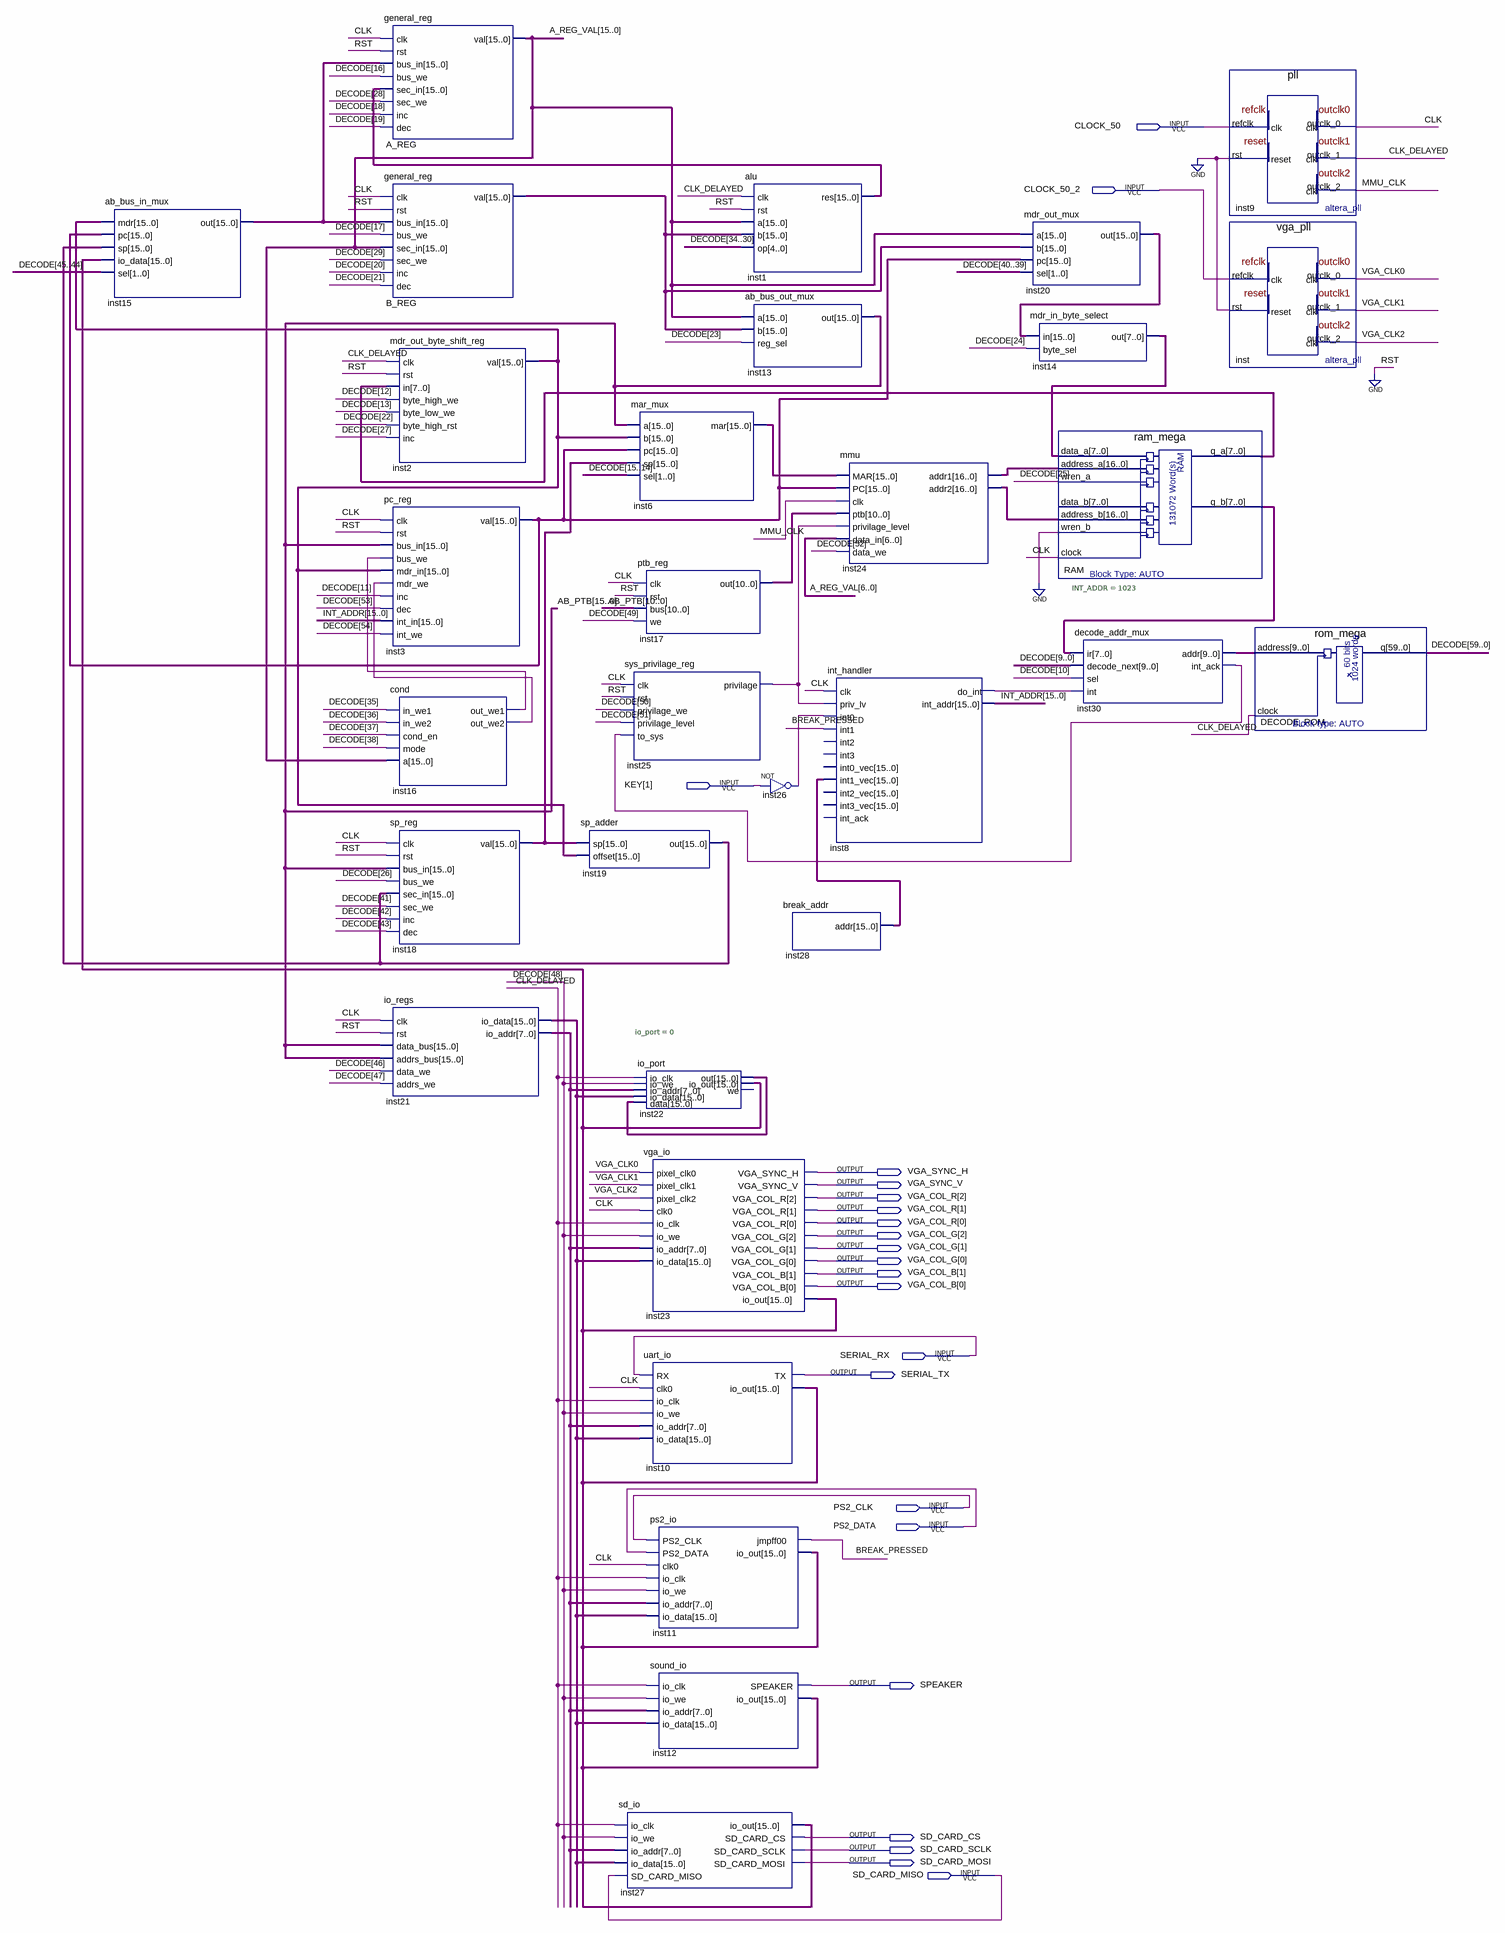
[diagram p0: schematic sheet]
// Quartus schematic scp.bdf as structural Verilog: 31 symbols, 22 pins
module scp (
  input  CLOCK_50,
  input  CLOCK_50_2,
  input  [1:1] KEY,
  input  SERIAL_RX,
  input  PS2_CLK,
  input  PS2_DATA,
  input  SD_CARD_MISO,
  output VGA_SYNC_H,
  output VGA_SYNC_V,
  output [2:0] VGA_COL_R,
  output [2:0] VGA_COL_G,
  output [1:0] VGA_COL_B,
  output SERIAL_TX,
  output SPEAKER,
  output SD_CARD_CS,
  output SD_CARD_SCLK,
  output SD_CARD_MOSI
);

  wire BREAK_PRESSED, CLK, CLK_DELAYED, inst8_do_int, inst16_out_we1, inst16_out_we2, inst25_privilage,
       inst26_out, inst30_int_ack, MMU_CLK, VGA_CLK0, VGA_CLK1, VGA_CLK2;
  wire [7:0] inst14_out, inst21_io_addr, RAM_q_a, RAM_q_b;
  wire [9:0] inst30_addr;
  wire [10:0] inst17_out;
  wire [15:0] A_REG_VAL, AB_PTB, B_REG_val, inst1_res, inst2_val, inst3_val, inst6_mar, inst15_out,
       inst18_val, inst19_out, inst20_out, inst21_io_data, inst22_io_out, inst22_out, inst28_addr, INT_ADDR;
  wire [16:0] inst24_addr1, inst24_addr2;
  wire [59:0] DECODE;

  ab_bus_in_mux inst15 (
    .mdr(inst2_val), .pc(inst3_val), .sp(inst19_out), .io_data(inst22_io_out), .sel(DECODE[45:44]),
    .out(inst15_out));
  general_reg A_REG (
    .clk(CLK), .rst(1'b0), .bus_in(inst15_out), .bus_we(DECODE[16]), .sec_in(inst1_res), .sec_we(DECODE[28]),
    .inc(DECODE[18]), .dec(DECODE[19]), .val(A_REG_VAL));
  general_reg B_REG (
    .clk(CLK), .rst(1'b0), .bus_in(inst15_out), .bus_we(DECODE[17]), .sec_in(A_REG_VAL), .sec_we(DECODE[29]),
    .inc(DECODE[20]), .dec(DECODE[21]), .val(B_REG_val));
  mdr_out_byte_shift_reg inst2 (
    .clk(CLK_DELAYED), .rst(1'b0), .in(RAM_q_a), .byte_high_we(DECODE[12]), .byte_low_we(DECODE[13]),
    .byte_high_rst(DECODE[22]), .inc(DECODE[27]), .val(inst2_val));
  pc_reg inst3 (
    .clk(CLK), .rst(1'b0), .bus_in(AB_PTB), .bus_we(inst16_out_we1), .mdr_in(inst2_val),
    .mdr_we(inst16_out_we2), .inc(DECODE[11]), .dec(DECODE[53]), .int_in(INT_ADDR), .int_we(DECODE[54]),
    .val(inst3_val));
  cond inst16 (
    .in_we1(DECODE[35]), .in_we2(DECODE[36]), .cond_en(DECODE[37]), .mode(DECODE[38]), .a(A_REG_VAL),
    .out_we1(inst16_out_we1), .out_we2(inst16_out_we2));
  sp_reg inst18 (
    .clk(CLK), .rst(1'b0), .bus_in(AB_PTB), .bus_we(DECODE[26]), .sec_in(inst19_out), .sec_we(DECODE[41]),
    .inc(DECODE[42]), .dec(DECODE[43]), .val(inst18_val));
  io_regs inst21 (
    .clk(CLK), .rst(1'b0), .data_bus(AB_PTB), .addrs_bus(AB_PTB), .data_we(DECODE[46]),
    .addrs_we(DECODE[47]), .io_data(inst21_io_data), .io_addr(inst21_io_addr));
  sp_adder inst19 (.sp(inst18_val), .offset(inst2_val), .out(inst19_out));
  mar_mux inst6 (.a(AB_PTB), .b(inst2_val), .pc(inst3_val), .sp(inst18_val), .sel(DECODE[15:14]), .mar(inst6_mar));
  ptb_reg inst17 (.clk(CLK), .rst(1'b0), .bus(AB_PTB[10:0]), .we(DECODE[49]), .out(inst17_out));
  sys_privilage_reg inst25 (
    .clk(CLK), .rst(1'b0), .privilage_we(DECODE[50]), .privilage_level(DECODE[51]), .to_sys(inst30_int_ack),
    .privilage(inst25_privilage));
  io_port #(.io_port(0)) inst22 (
    .io_clk(CLK_DELAYED), .io_we(DECODE[48]), .io_addr(inst21_io_addr), .io_data(inst21_io_data),
    .data(inst22_out), .out(inst22_out), .io_out(inst22_io_out));  // open: we
  vga_io inst23 (
    .pixel_clk0(VGA_CLK0), .pixel_clk1(VGA_CLK1), .pixel_clk2(VGA_CLK2), .clk0(CLK), .io_clk(CLK_DELAYED),
    .io_we(DECODE[48]), .io_addr(inst21_io_addr), .io_data(inst21_io_data), .VGA_SYNC_H(VGA_SYNC_H),
    .VGA_SYNC_V(VGA_SYNC_V), .VGA_COL_R(VGA_COL_R), .VGA_COL_G(VGA_COL_G), .VGA_COL_B(VGA_COL_B),
    .io_out(inst22_io_out));
  uart_io inst10 (
    .RX(SERIAL_RX), .clk0(CLK), .io_clk(CLK_DELAYED), .io_we(DECODE[48]), .io_addr(inst21_io_addr),
    .io_data(inst21_io_data), .TX(SERIAL_TX), .io_out(inst22_io_out));
  ps2_io inst11 (
    .PS2_CLK(PS2_CLK), .PS2_DATA(PS2_DATA), .clk0(CLK), .io_clk(CLK_DELAYED), .io_we(DECODE[48]),
    .io_addr(inst21_io_addr), .io_data(inst21_io_data), .jmpff00(BREAK_PRESSED), .io_out(inst22_io_out));
  sound_io inst12 (
    .io_clk(CLK_DELAYED), .io_we(DECODE[48]), .io_addr(inst21_io_addr), .io_data(inst21_io_data),
    .SPEAKER(SPEAKER), .io_out(inst22_io_out));
  sd_io inst27 (
    .io_clk(CLK_DELAYED), .io_we(DECODE[48]), .io_addr(inst21_io_addr), .io_data(inst21_io_data),
    .SD_CARD_MISO(SD_CARD_MISO), .io_out(inst22_io_out), .SD_CARD_CS(SD_CARD_CS),
    .SD_CARD_SCLK(SD_CARD_SCLK), .SD_CARD_MOSI(SD_CARD_MOSI));
  alu inst1 (.clk(CLK_DELAYED), .rst(1'b0), .a(A_REG_VAL), .b(B_REG_val), .op(DECODE[34:30]), .res(inst1_res));
  ab_bus_out_mux inst13 (.a(A_REG_VAL), .b(B_REG_val), .reg_sel(DECODE[23]), .out(AB_PTB));
  not inst26 (inst26_out, KEY[1]);
  break_addr inst28 (.addr(inst28_addr));
  mmu inst24 (
    .MAR(inst6_mar), .PC(inst3_val), .clk(MMU_CLK), .ptb(inst17_out), .privilage_level(inst25_privilage),
    .data_in(A_REG_VAL[6:0]), .data_we(DECODE[52]), .addr1(inst24_addr1), .addr2(inst24_addr2));
  int_handler inst8 (
    .clk(CLK), .priv_lv(inst25_privilage), .int0(inst26_out), .int1(BREAK_PRESSED), .int1_vec(inst28_addr),
    .do_int(inst8_do_int), .int_addr(INT_ADDR));  // open: int2, int3, int0_vec, int2_vec, int3_vec, int_ack
  mdr_out_mux inst20 (.a(A_REG_VAL), .b(B_REG_val), .pc(inst3_val), .sel(DECODE[40:39]), .out(inst20_out));
  mdr_in_byte_select inst14 (.in(inst20_out), .byte_sel(DECODE[24]), .out(inst14_out));
  ram_mega RAM (
    .data_a(inst14_out), .address_a(inst24_addr1), .wren_a(DECODE[25]), .address_b(inst24_addr2),
    .wren_b(1'b0), .clock(CLK), .q_a(RAM_q_a), .q_b(RAM_q_b));  // open: data_b
  decode_addr_mux #(.INT_ADDR(1023)) inst30 (
    .ir(RAM_q_b), .decode_next(DECODE[9:0]), .sel(DECODE[10]), .\int (inst8_do_int), .addr(inst30_addr),
    .int_ack(inst30_int_ack));
  pll inst9 (.refclk(CLOCK_50), .rst(1'b0), .outclk_0(CLK), .outclk_1(CLK_DELAYED), .outclk_2(MMU_CLK));
  vga_pll inst (.refclk(CLOCK_50_2), .rst(1'b0), .outclk_0(VGA_CLK0), .outclk_1(VGA_CLK1), .outclk_2(VGA_CLK2));
  rom_mega DECODE_ROM (.address(inst30_addr), .clock(CLK_DELAYED), .q(DECODE));
endmodule
